# Altium schematic sheet main.SchDoc
size A3; SheetNumber: 1; SheetTotal: 5
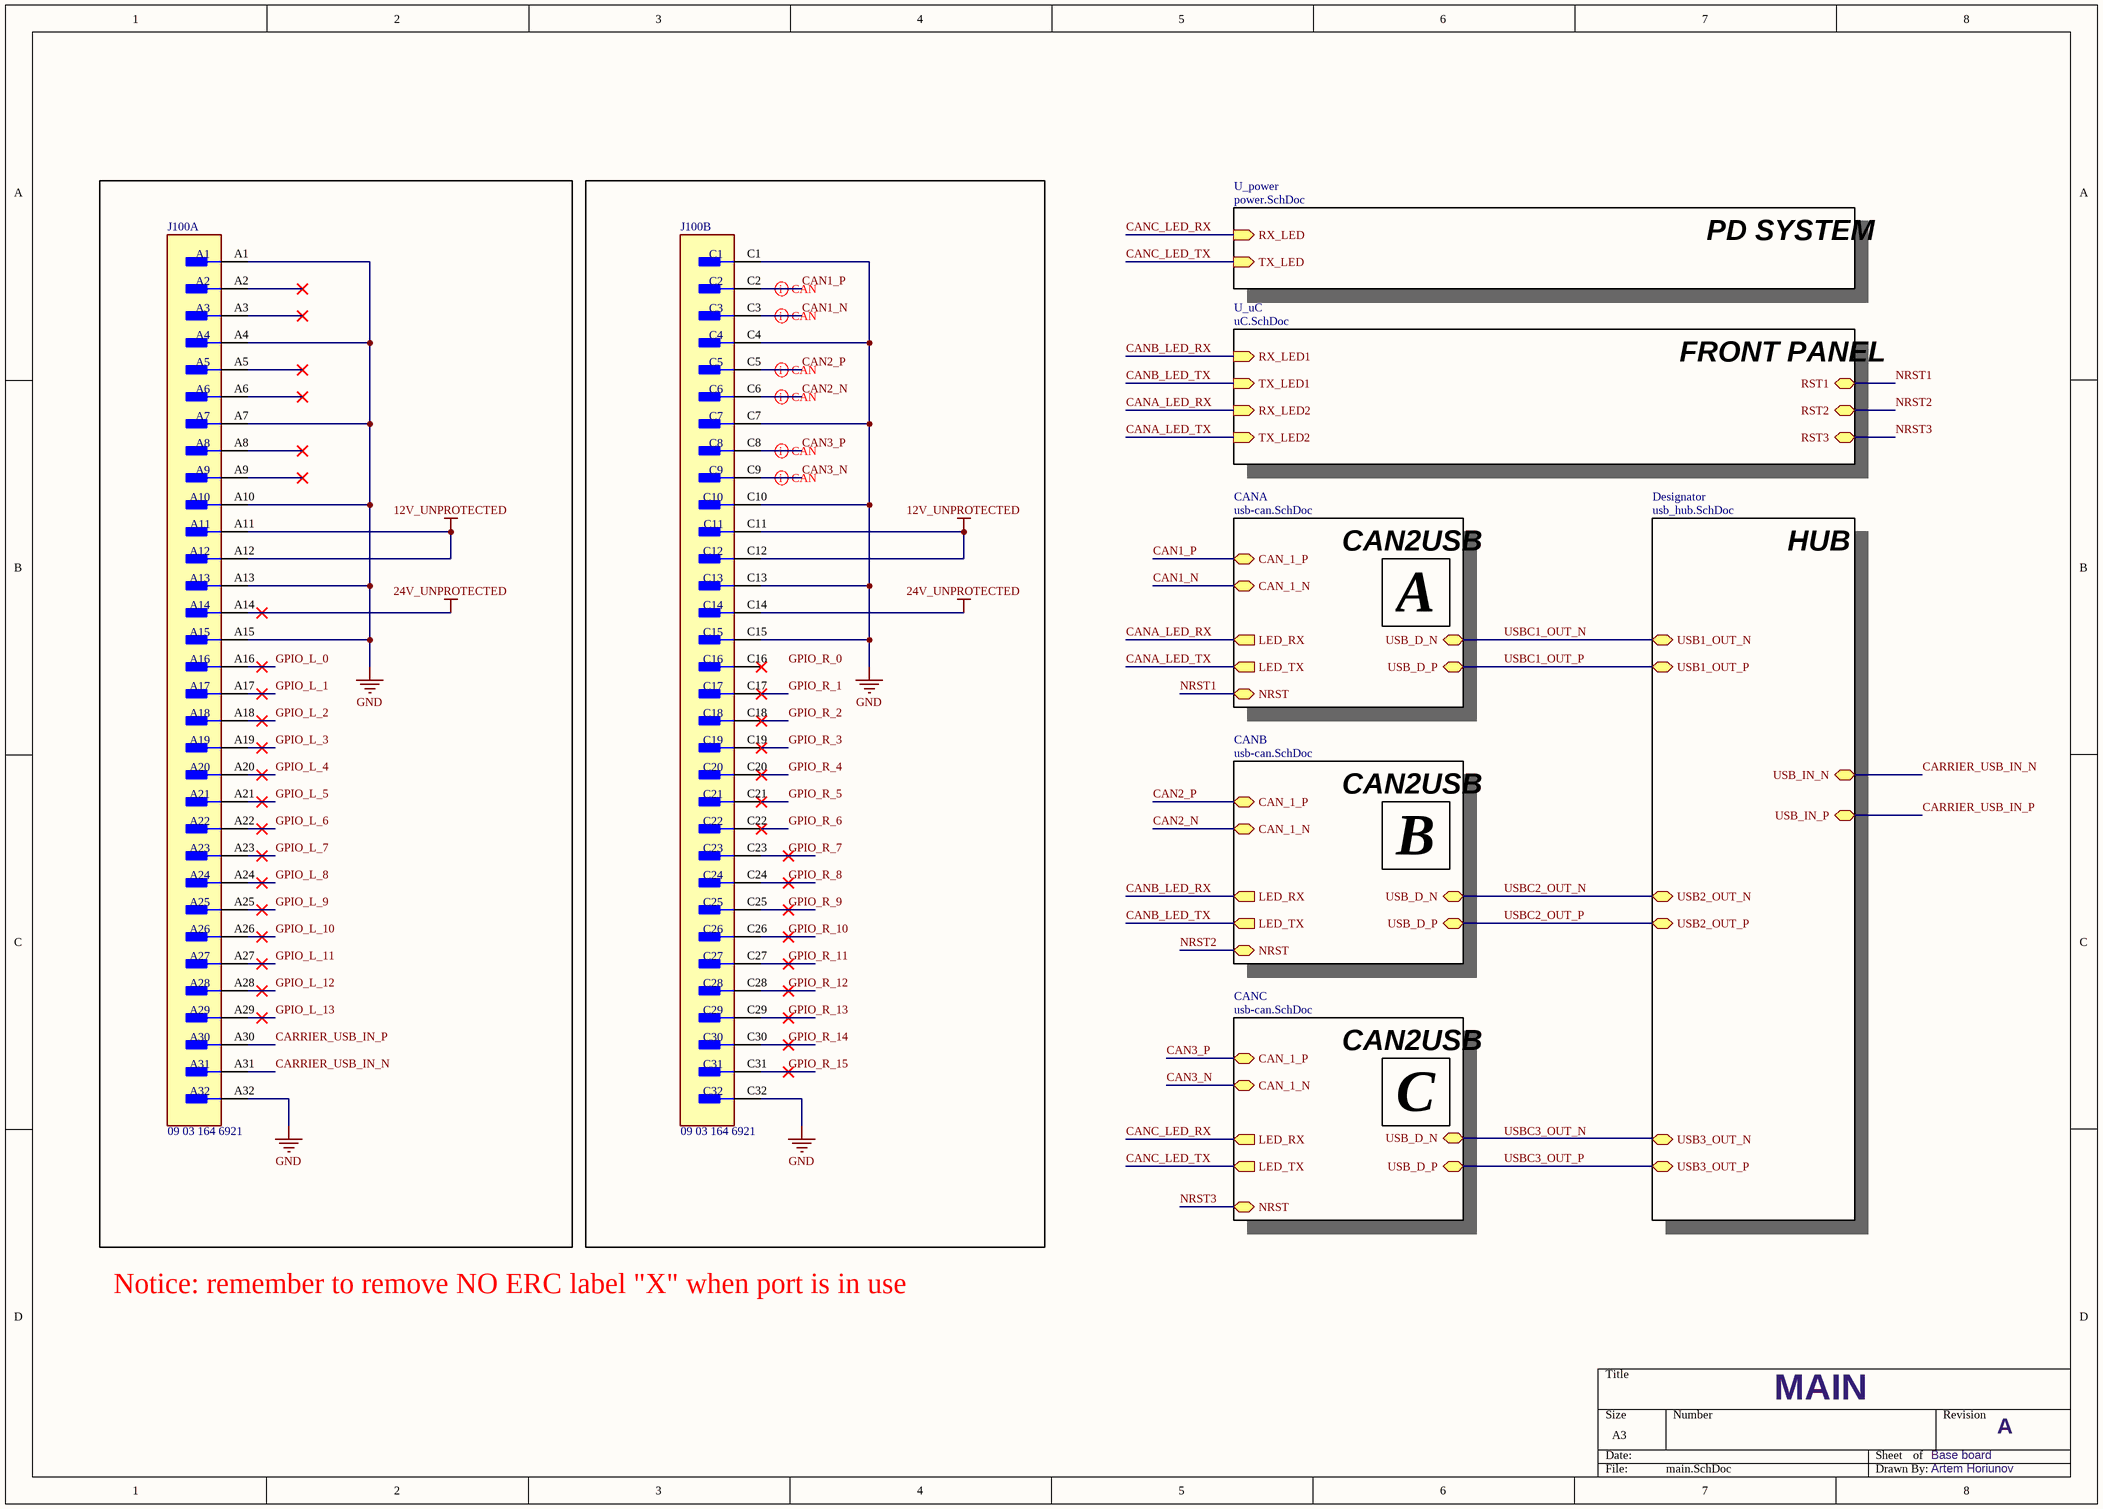
[diagram p0: main.SchDoc]

## Parts
J100  09 03 164 6921  [FP-09_03_164_6921-MFG]  (parts A,B of 2)

## Sub-sheets
CANA = usb-can.SchDoc: CAN_1_P (bidir), CAN_1_N (bidir), LED_RX (out), LED_TX (out), USB_D_N (bidir), USB_D_P (bidir), NRST (bidir)
CANB = usb-can.SchDoc: CAN_1_P (bidir), CAN_1_N (bidir), LED_RX (out), LED_TX (out), USB_D_N (bidir), USB_D_P (bidir), NRST (bidir)
CANC = usb-can.SchDoc: CAN_1_N (bidir), CAN_1_P (bidir), LED_RX (out), LED_TX (out), USB_D_N (bidir), USB_D_P (bidir), NRST (bidir)
Designator = usb_hub.SchDoc: USB3_OUT_N (bidir), USB3_OUT_P (bidir), USB2_OUT_N (bidir), USB2_OUT_P (bidir), USB1_OUT_N (bidir), USB1_OUT_P (bidir), USB_IN_N (bidir), USB_IN_P (bidir)
U_power = power.SchDoc: RX_LED (in), TX_LED (in)
U_uC = uC.SchDoc: RX_LED1 (in), TX_LED1 (in), RX_LED2 (in), TX_LED2 (in), RST1 (bidir), RST2 (bidir), RST3 (bidir)

## Nets
12V_UNPROTECTED: J100.A11 J100.A12 J100.C11 J100.C12
24V_UNPROTECTED: J100.A14 J100.C14
GND: J100.A1 J100.A4 J100.A7 J100.A10 J100.A13 J100.A15 J100.A32 J100.C1 J100.C4 J100.C7 J100.C10 J100.C13 J100.C15 J100.C32
CAN1_N: J100.C3 ; sheet CANA/CAN_1_N
CAN1_P: J100.C2 ; sheet CANA/CAN_1_P
CAN2_N: J100.C6 ; sheet CANB/CAN_1_N
CAN2_P: J100.C5 ; sheet CANB/CAN_1_P
CAN3_N: J100.C9 ; sheet CANC/CAN_1_N
CAN3_P: J100.C8 ; sheet CANC/CAN_1_P
CANA_LED_RX: sheet U_uC/RX_LED2, sheet CANA/LED_RX
CANA_LED_TX: sheet U_uC/TX_LED2, sheet CANA/LED_TX
CANB_LED_RX: sheet U_uC/RX_LED1, sheet CANB/LED_RX
CANB_LED_TX: sheet U_uC/TX_LED1, sheet CANB/LED_TX
CANC_LED_RX: sheet U_power/RX_LED, sheet CANC/LED_RX
CANC_LED_TX: sheet U_power/TX_LED, sheet CANC/LED_TX
CARRIER_USB_IN_N: J100.A31 ; sheet Designator/USB_IN_N
CARRIER_USB_IN_P: J100.A30 ; sheet Designator/USB_IN_P
GPIO_L_0: J100.A16
GPIO_L_1: J100.A17
GPIO_L_2: J100.A18
GPIO_L_3: J100.A19
GPIO_L_4: J100.A20
GPIO_L_5: J100.A21
GPIO_L_6: J100.A22
GPIO_L_7: J100.A23
GPIO_L_8: J100.A24
GPIO_L_9: J100.A25
GPIO_L_10: J100.A26
GPIO_L_11: J100.A27
GPIO_L_12: J100.A28
GPIO_L_13: J100.A29
GPIO_R_1: J100.C17
GPIO_R_2: J100.C18
GPIO_R_3: J100.C19
GPIO_R_4: J100.C20
GPIO_R_5: J100.C21
GPIO_R_6: J100.C22
GPIO_R_7: J100.C23
GPIO_R_8: J100.C24
GPIO_R_9: J100.C25
GPIO_R_10: J100.C26
GPIO_R_11: J100.C27
GPIO_R_12: J100.C28
GPIO_R_13: J100.C29
GPIO_R_14: J100.C30
GPIO_R_15: J100.C31
NRST1: sheet U_uC/RST1, sheet CANA/NRST
NRST2: sheet U_uC/RST2, sheet CANB/NRST
NRST3: sheet U_uC/RST3, sheet CANC/NRST
USBC1_OUT_N: sheet CANA/USB_D_N, sheet Designator/USB1_OUT_N
USBC1_OUT_P: sheet CANA/USB_D_P, sheet Designator/USB1_OUT_P
USBC2_OUT_N: sheet CANB/USB_D_N, sheet Designator/USB2_OUT_N
USBC2_OUT_P: sheet CANB/USB_D_P, sheet Designator/USB2_OUT_P
USBC3_OUT_P: sheet CANC/USB_D_P, sheet Designator/USB3_OUT_P
(unnamed): sheet CANC/USB_D_N, sheet Designator/USB3_OUT_N

Not connected (* = marked no-connect by the designer): J100 A2* A3* A5* A6* A8* A9* C16*

## Layout directives
differential pair; differential pair class CAN: CAN1_N, CAN1_P, CAN2_N, CAN2_P, CAN3_N, CAN3_P

## Notes on the sheet
- PD SYSTEM
- FRONT PANEL
- CAN2USB
- HUB
- A
- B
- C
- Notice: remember to remove NO ERC label "X" when port is in use
- MAIN
- Base board
- Artem Horiunov
- Labels drawn without touching a wire or pin: GPIO_R_0, USBC3_OUT_N

## Library data of the parts
J100 = CMP-33111-000001-1: CONN DIN HDR 96POS PCB RA; Manufacturer: Harting; Pitch: 2.54mm; Number Of Contacts: 64; Current Rating: 2A; Conn Orientation: Right Angle; Conn Gender: Male; Device Class L1: Connectors; Package: 0; Number Of Rows: 2; ComponentLink2URL: https://b2b.harting.com/files/download/PRD/PDF_DS/09031200203_100580339DRW000B.pdf; Height: 11mm; Temperature Range Low: -55°C; Digikey Description: CONN DIN HDR 96POS PCB RA; Mouser Description: Conn DIN 41612 M 64 POS 2.54mm Solder RA Thru-Hole Box; Footprint Url: https://b2b.harting.com/files/download/PRD/PDF_TS/0903164X921_100072506DRW176A.pdf; Lead Free: Yes; RoHS: TRUE; Device Class L2: Backplane Connectors; Category: Conn; Manufacturer Part Number: 09 03 164 6921; Temperature Range High: +125°C; Temperature: -55°C to +125°C; ComponentLink2Description: Datasheet; Octopart: https://octopart.com/09031646921-harting+elektronik-42933; Device Class L3: unset; Automotive: No; Contact Material: Gold,Nickel